# Altium schematic sheet prec_3V_LDO.SchDoc
size A3; Organization: Altium Limited; Address1: L3, 12a Rodborough Rd; Address2: Frenchs Forest; Address3: NSW; Address4: Australia 2086
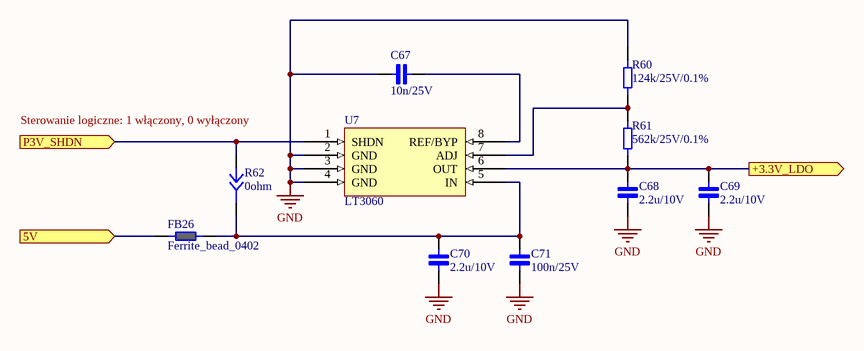
[diagram p0: prec_3V_LDO.SchDoc]

## Parts
C67  10n/25V  [Cap_0402]
C68  2.2u/10V  [Cap_0402]
C69  2.2u/10V  [Cap_0402]
C70  2.2u/10V  [Cap_0402]
C71  100n/25V  [Cap_0402]
FB26  Ferrite_bead_0402  [FERRITE_0402]
R60  124k/25V/0.1%  [RES_0402]
R61  562k/25V/0.1%  [RES_0402]
R62  0ohm  [Jumper 2]
U7  LT3060  [TS8]

## Ports
5V (in), +3.3V_LDO (out), P3V_SHDN (in)

## Nets
GND: C67.1 C68.1 C69.1 C70.1 C71.1 R60.2 U7.2(GND) U7.3(GND) U7.4(GND)
5V: FB26.1 ; port 5V
+3.3V_LDO: C68.2 C69.2 R61.1 U7.6(OUT) ; port +3.3V_LDO
P3V_SHDN: R62.2 U7.1(SHDN) ; port P3V_SHDN
NetC67_2: C67.2 U7.8(REF/BYP)
NetC70_2: C70.2 C71.2 FB26.2 R62.2 U7.5(IN)
NetR60_1: R60.1 R61.2 U7.7(ADJ)

## Notes on the sheet
- Sterowanie logiczne: 1 włączony, 0 wyłączony
- Title
- Size:
- Date:
- A3
- Number:
- Time:
- Revision:
- Sheet
- of
- File:

## Library data of the parts
C67 = Cap_0402_10n: Ceramic Capacitor 10n / 0402 / 25V / ±5%, Wurth Elektronik MLCC; ComponentLink1Description: New link; ComponentLink1URL: https://www.we-online.com/catalog/en/WCAP-CSGP-25VDC
C68-C70 = Cap_0402_2.2u: Ceramic Capacitor 2.2uF / 0402 / 10V / ±5%, Wurth Elektronik MLCC
C71 = Cap_0402_100n: Ceramic Capacitor 100n / 0402 / 25V / ±5%, Wurth Elektronik MLCC; ComponentLink1Description: New link; ComponentLink1URL: https://www.we-online.com/catalog/en/WCAP-CSGP-25VDC
FB26 = Ferrite_bead_0402: Ferrite bead, wurth 74269241102
R60 = Res_0402_124k: Vishay, thin film resistor 124k/25V/0.1%
R61 = Res_0402_562k: Vishay, thin film resistor 562k/25V/0.1%
R62 = Jumper
U7 = Lt3060: 45V VIN, Micropower, / Low Noise, 100mA Low / Dropout, Linear Regulator